# Altium schematic sheet 2_OTHER.schdoc
size 429 x 307 mm; Symbol: Drawing-Symbol_A4; Device: Drawing-Symbol_A4; @Project Name: Custom Keyboard; @Page Count: 2; @Update Date: 2025-12-16; @Create Date: 2025-12-12; @Schematic Name: Custom Keyboard; @Page No: 2; @Page Name: OTHER; Version: V1.0; Page Size: A3; Drawn: Michael Varga; @Create Time: 16:22:12; @Update Time: 17:03:40; Width: 1655; Height: 1170; Region Start: 1; X Region Count: 6; Y Region Count: 4; Blade Width: 10; Title Block Position: 3; @Board Name: Custom Keyboard
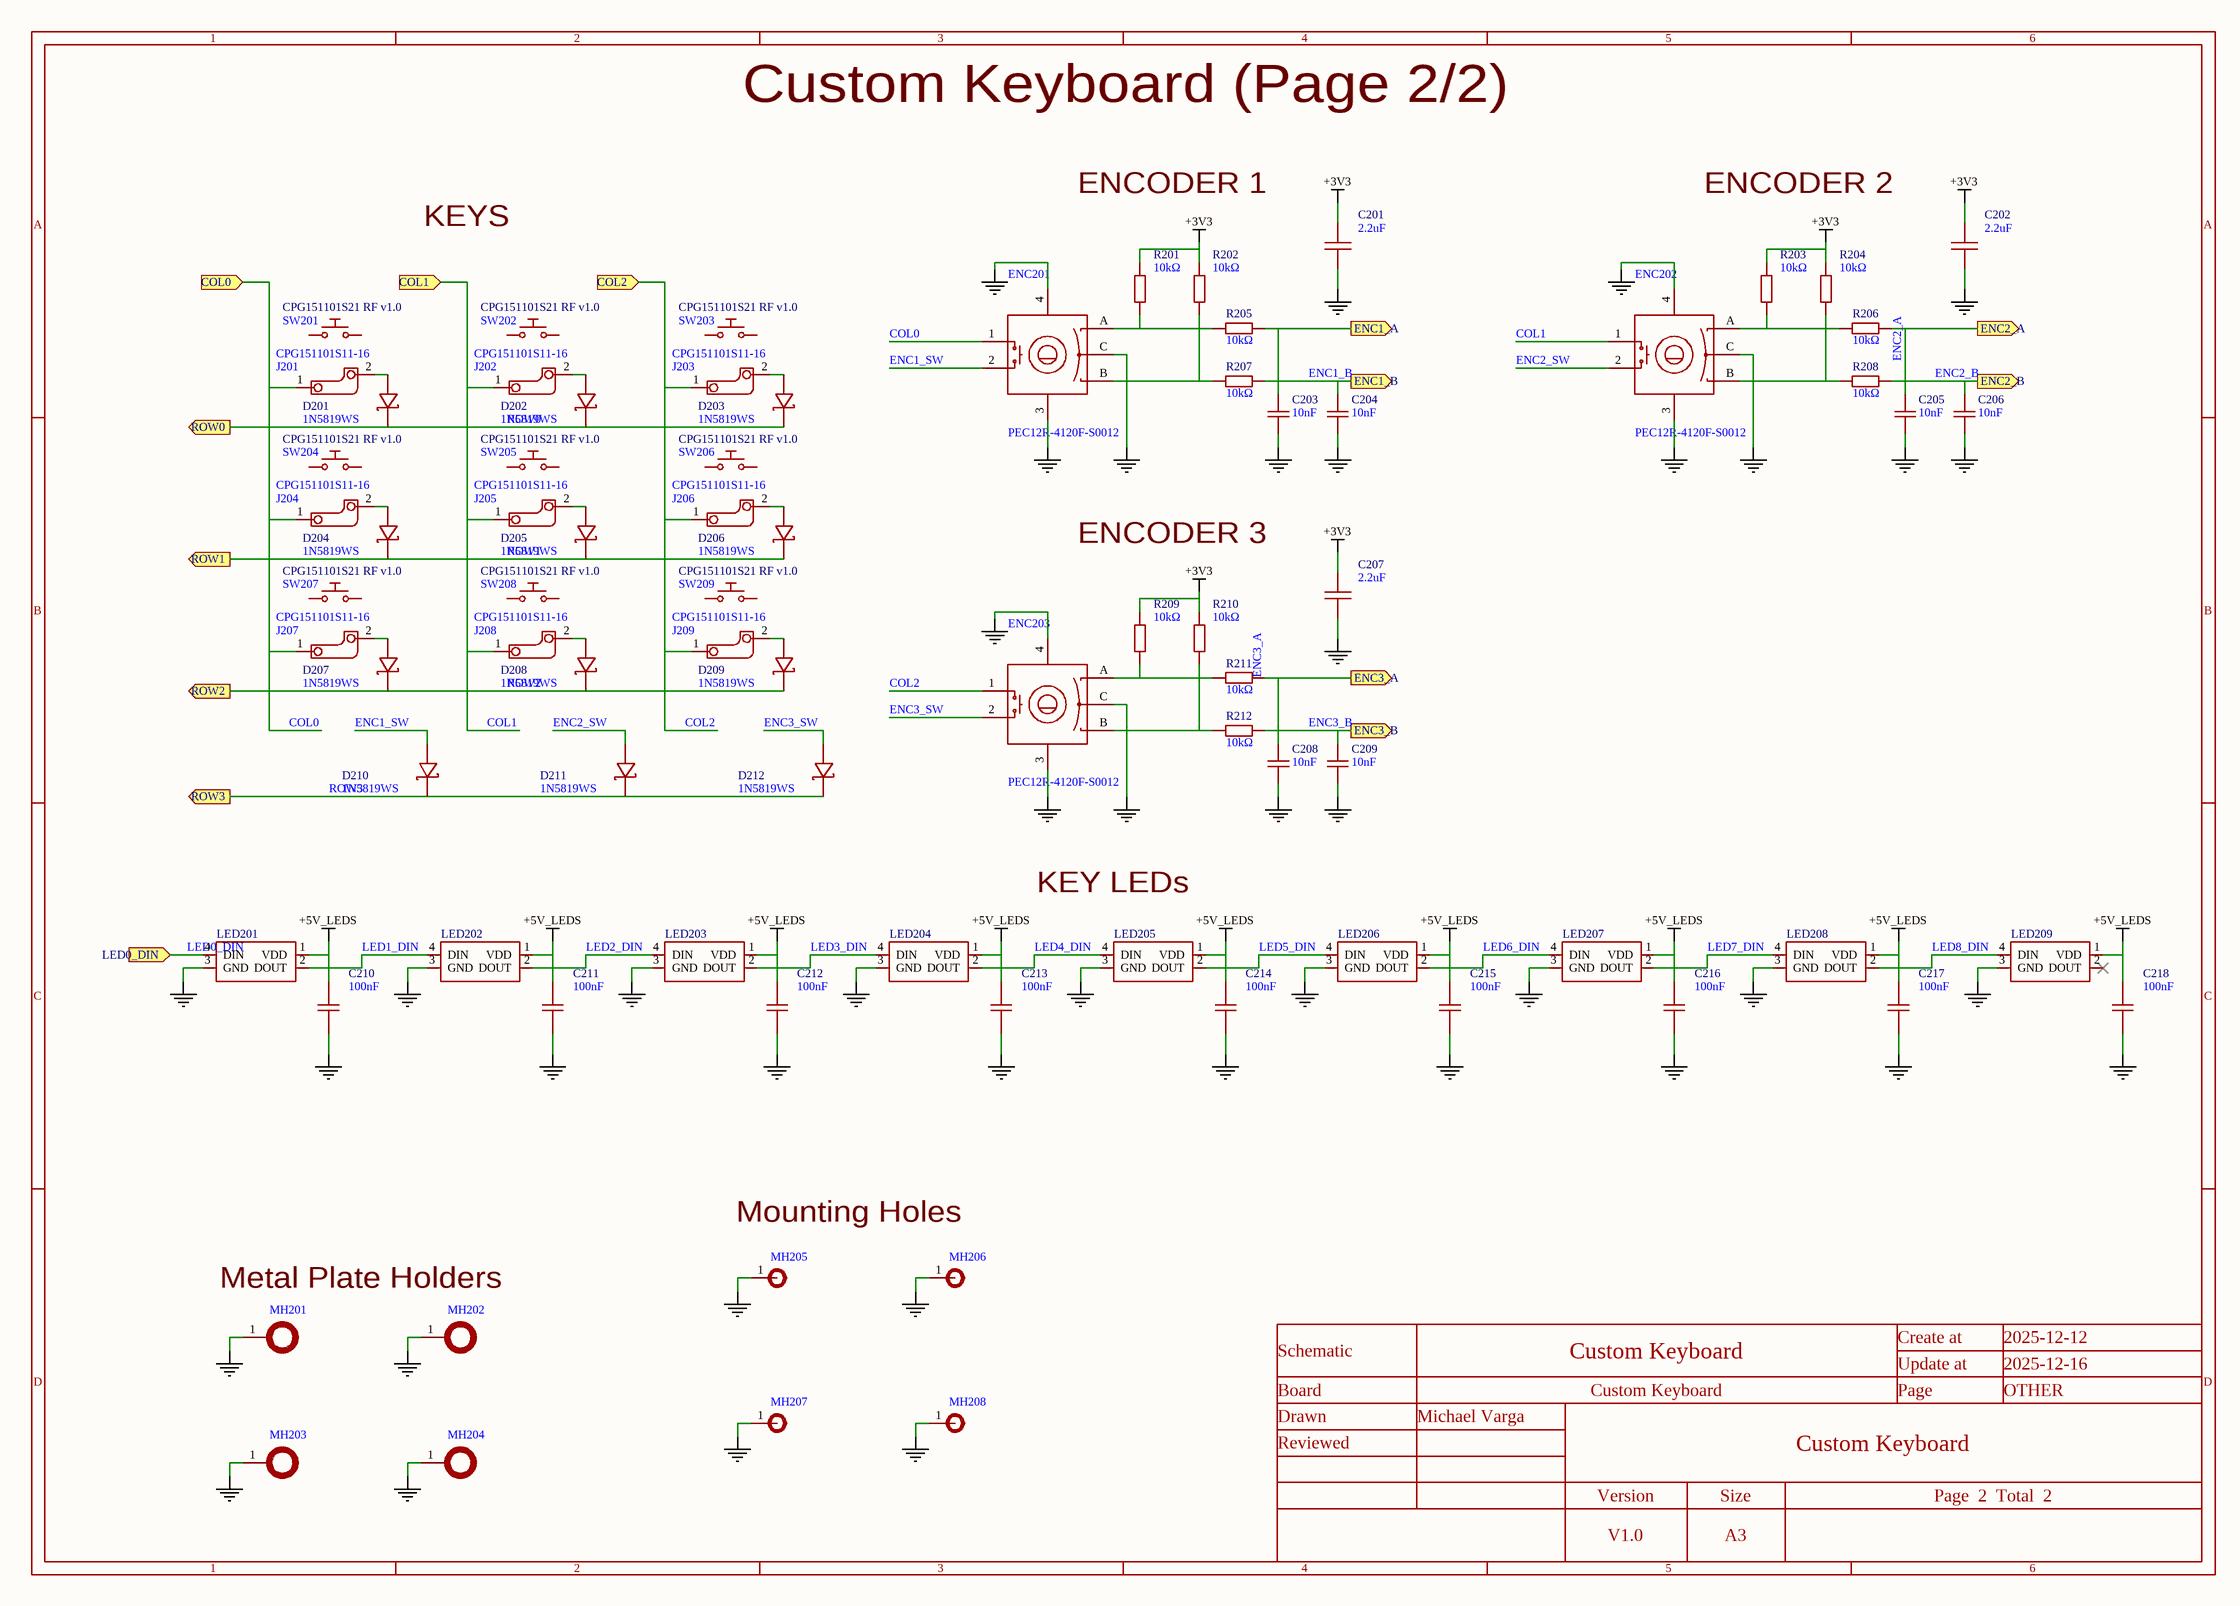
[diagram p0: 2_OTHER.schdoc]

## Parts
C201  2.2uF  [C0402]
C202  2.2uF  [C0402]
C203  10nF  [C0402]
C204  10nF  [C0402]
C205  10nF  [C0402]
C206  10nF  [C0402]
C207  2.2uF  [C0402]
C208  10nF  [C0402]
C209  10nF  [C0402]
C210  100nF  [C0402]
C211  100nF  [C0402]
C212  100nF  [C0402]
C213  100nF  [C0402]
C214  100nF  [C0402]
C215  100nF  [C0402]
C216  100nF  [C0402]
C217  100nF  [C0402]
C218  100nF  [C0402]
D201  1N5819WS  [SOD-323_L1.8-W1.3-LS2.5-RD]
D202  1N5819WS  [SOD-323_L1.8-W1.3-LS2.5-RD]
D203  1N5819WS  [SOD-323_L1.8-W1.3-LS2.5-RD]
D204  1N5819WS  [SOD-323_L1.8-W1.3-LS2.5-RD]
D205  1N5819WS  [SOD-323_L1.8-W1.3-LS2.5-RD]
D206  1N5819WS  [SOD-323_L1.8-W1.3-LS2.5-RD]
D207  1N5819WS  [SOD-323_L1.8-W1.3-LS2.5-RD]
D208  1N5819WS  [SOD-323_L1.8-W1.3-LS2.5-RD]
D209  1N5819WS  [SOD-323_L1.8-W1.3-LS2.5-RD]
D210  1N5819WS  [SOD-323_L1.8-W1.3-LS2.5-RD]
D211  1N5819WS  [SOD-323_L1.8-W1.3-LS2.5-RD]
D212  1N5819WS  [SOD-323_L1.8-W1.3-LS2.5-RD]
ENC201  PEC12R-4120F-S0012  [SW-TH_PEC12R-4120F-S0012]
ENC202  PEC12R-4120F-S0012  [SW-TH_PEC12R-4120F-S0012]
ENC203  PEC12R-4120F-S0012  [SW-TH_PEC12R-4120F-S0012]
J201  CPG151101S11-16  [SMD_KEYBOARD-SW]
J202  CPG151101S11-16  [SMD_KEYBOARD-SW]
J203  CPG151101S11-16  [SMD_KEYBOARD-SW]
J204  CPG151101S11-16  [SMD_KEYBOARD-SW]
J205  CPG151101S11-16  [SMD_KEYBOARD-SW]
J206  CPG151101S11-16  [SMD_KEYBOARD-SW]
J207  CPG151101S11-16  [SMD_KEYBOARD-SW]
J208  CPG151101S11-16  [SMD_KEYBOARD-SW]
J209  CPG151101S11-16  [SMD_KEYBOARD-SW]
LED201  SK6812MINI-E  [LED-SMD_L3.2-W2.8-LS5.9_SK6812MINI-E]  (value not drawn)
LED202  SK6812MINI-E  [LED-SMD_L3.2-W2.8-LS5.9_SK6812MINI-E]  (value not drawn)
LED203  SK6812MINI-E  [LED-SMD_L3.2-W2.8-LS5.9_SK6812MINI-E]  (value not drawn)
LED204  SK6812MINI-E  [LED-SMD_L3.2-W2.8-LS5.9_SK6812MINI-E]  (value not drawn)
LED205  SK6812MINI-E  [LED-SMD_L3.2-W2.8-LS5.9_SK6812MINI-E]  (value not drawn)
LED206  SK6812MINI-E  [LED-SMD_L3.2-W2.8-LS5.9_SK6812MINI-E]  (value not drawn)
LED207  SK6812MINI-E  [LED-SMD_L3.2-W2.8-LS5.9_SK6812MINI-E]  (value not drawn)
LED208  SK6812MINI-E  [LED-SMD_L3.2-W2.8-LS5.9_SK6812MINI-E]  (value not drawn)
LED209  SK6812MINI-E  [LED-SMD_L3.2-W2.8-LS5.9_SK6812MINI-E]  (value not drawn)
MH201  (no value)  [STANDOFF_M2.5x3.5MM_RF_v1.0]
MH202  (no value)  [STANDOFF_M2.5x3.5MM_RF_v1.0]
MH203  (no value)  [STANDOFF_M2.5x3.5MM_RF_v1.0]
MH204  (no value)  [STANDOFF_M2.5x3.5MM_RF_v1.0]
MH205  (no value)  [MH_7.5X3.2MM_RF_v1.0]
MH206  (no value)  [MH_7.5X3.2MM_RF_v1.0]
MH207  (no value)  [MH_7.5X3.2MM_RF_v1.0]
MH208  (no value)  [MH_7.5X3.2MM_RF_v1.0]
R201  10kΩ  [R0402]
R202  10kΩ  [R0402]
R203  10kΩ  [R0402]
R204  10kΩ  [R0402]
R205  10kΩ  [R0402]
R206  10kΩ  [R0402]
R207  10kΩ  [R0402]
R208  10kΩ  [R0402]
R209  10kΩ  [R0402]
R210  10kΩ  [R0402]
R211  10kΩ  [R0402]
R212  10kΩ  [R0402]
SW201  CPG151101S21  [KEY-TH_CPG1511F01S0X]  (value not drawn)
SW202  CPG151101S21  [KEY-TH_CPG1511F01S0X]  (value not drawn)
SW203  CPG151101S21  [KEY-TH_CPG1511F01S0X]  (value not drawn)
SW204  CPG151101S21  [KEY-TH_CPG1511F01S0X]  (value not drawn)
SW205  CPG151101S21  [KEY-TH_CPG1511F01S0X]  (value not drawn)
SW206  CPG151101S21  [KEY-TH_CPG1511F01S0X]  (value not drawn)
SW207  CPG151101S21  [KEY-TH_CPG1511F01S0X]  (value not drawn)
SW208  CPG151101S21  [KEY-TH_CPG1511F01S0X]  (value not drawn)
SW209  CPG151101S21  [KEY-TH_CPG1511F01S0X]  (value not drawn)

## Ports
COL0 (in), COL1 (in), COL2 (in), ENC1_A (out), ENC1_B (out), ENC2_A (out), ENC2_B (out), ENC3_A (out), ENC3_B (out), LED0_DIN (in), ROW0 (out), ROW1 (out), ROW2 (out), ROW3 (out)

## Nets
+3V3: C201.2 C202.2 C207.2 R201.2 R202.2 R203.2 R204.2 R209.2 R210.2
+5V_LEDS: C210.2 C211.2 C212.2 C213.2 C214.2 C215.2 C216.2 C217.2 C218.2 LED201.1(VDD) LED202.1(VDD) LED203.1(VDD) LED204.1(VDD) LED205.1(VDD) LED206.1(VDD) LED207.1(VDD) LED208.1(VDD) LED209.1(VDD)
GND: C201.1 C202.1 C203.1 C204.1 C205.1 C206.1 C207.1 C208.1 C209.1 C210.1 C211.1 C212.1 C213.1 C214.1 C215.1 C216.1 C217.1 C218.1 ENC201.3 ENC201.4 ENC201.C ENC202.3 ENC202.4 ENC202.C ENC203.3 ENC203.4 ENC203.C LED201.3(GND) LED202.3(GND) LED203.3(GND) LED204.3(GND) LED205.3(GND) LED206.3(GND) LED207.3(GND) LED208.3(GND) LED209.3(GND) MH201.1 MH202.1 MH203.1 MH204.1 MH205.1 MH206.1 MH207.1 MH208.1
COL0: ENC201.1 J201.1 J204.1 J207.1 ; port COL0
COL1: ENC202.1 J202.1 J205.1 J208.1 ; port COL1
COL2: ENC203.1 J203.1 J206.1 J209.1 ; port COL2
ENC1_A: C203.2 R205.1 ; port ENC1_A
ENC1_B: C204.2 R207.1 ; port ENC1_B
ENC1_SW: D210.2(A) ENC201.2
ENC2_A: C205.2 R206.1 ; port ENC2_A
ENC2_B: C206.2 R208.1 ; port ENC2_B
ENC2_SW: D211.2(A) ENC202.2
ENC3_A: C208.2 R211.1 ; port ENC3_A
ENC3_B: C209.2 R212.1 ; port ENC3_B
ENC3_SW: D212.2(A) ENC203.2
LED0_DIN: LED201.4(DIN) ; port LED0_DIN
LED1_DIN: LED201.2(DOUT) LED202.4(DIN)
LED2_DIN: LED202.2(DOUT) LED203.4(DIN)
LED3_DIN: LED203.2(DOUT) LED204.4(DIN)
LED4_DIN: LED204.2(DOUT) LED205.4(DIN)
LED5_DIN: LED205.2(DOUT) LED206.4(DIN)
LED6_DIN: LED206.2(DOUT) LED207.4(DIN)
LED7_DIN: LED207.2(DOUT) LED208.4(DIN)
LED8_DIN: LED208.2(DOUT) LED209.4(DIN)
ROW0: D201.1(K) D202.1(K) D203.1(K) ; port ROW0
ROW1: D204.1(K) D205.1(K) D206.1(K) ; port ROW1
ROW2: D207.1(K) D208.1(K) D209.1(K) ; port ROW2
ROW3: D210.1(K) D211.1(K) D212.1(K) ; port ROW3
NetD201_2: D201.2(A) J201.2
NetD202_2: D202.2(A) J202.2
NetD203_2: D203.2(A) J203.2
NetD204_2: D204.2(A) J204.2
NetD205_2: D205.2(A) J205.2
NetD206_2: D206.2(A) J206.2
NetD207_2: D207.2(A) J207.2
NetD208_2: D208.2(A) J208.2
NetD209_2: D209.2(A) J209.2
NetENC201_A: ENC201.A R201.1 R205.2
NetENC201_B: ENC201.B R202.1 R207.2
NetENC202_A: ENC202.A R203.1 R206.2
NetENC202_B: ENC202.B R204.1 R208.2
NetENC203_A: ENC203.A R209.1 R211.2
NetENC203_B: ENC203.B R210.1 R212.2

Not connected (* = marked no-connect by the designer): LED209 2(DOUT)*

## Notes on the sheet
- Custom Keyboard (Page 2/2)
- ENCODER 1
- ENCODER 2
- KEYS
- ENCODER 3
- KEY LEDs
- Mounting Holes
- Metal Plate Holders
- 1
- 2
- 3
- 4
- 5
- 6
- A
- B
- C
- Schematic
- Custom Keyboard
- Create at
- Update at
- 2025-12-12
- 2025-12-16
- D
- Board
- Drawn
- Michael Varga
- Page
- OTHER
- Reviewed
- Version
- Size
- Page  2  Total  2
- V1.0
- A3

## Library data of the parts
C201 C202 C207 = CL05A225MQ5NSNC: Manufacturer: SAMSUNG(三星); Add into BOM: yes; Tolerance: ±20%; Voltage Rating: 6.3V; Temperature Coefficient: X5R; Symbol: CL05A225MQ5NSNC; Device: CL05A225MQ5NSNC; LCSC Part Name: 2.2uF ±20% 6.3V; Supplier Part: C12530; Manufacturer Part: CL05A225MQ5NSNC; Supplier Footprint: 0402; JLCPCB Part Class: Basic Part; Datasheet: https://item.szlcsc.com/datasheet/CL05A225MQ5NSNC/13164.html; Supplier: LCSC; Convert to PCB: yes; Value: 2.2uF
C203-C206 C208 C209 = CL05B103KB5NNNC: Manufacturer: SAMSUNG(三星); Add into BOM: yes; Tolerance: ±10%; Voltage Rating: 50V; Temperature Coefficient: X7R; Symbol: CL05B103KB5NNNC; Device: CL05B103KB5NNNC; LCSC Part Name: 10nF ±10% 50V; Supplier Part: C15195; Manufacturer Part: CL05B103KB5NNNC; Supplier Footprint: 0402; JLCPCB Part Class: Basic Part; Datasheet: https://item.szlcsc.com/datasheet/CL05B103KB5NNNC/15869.html; Supplier: LCSC; Convert to PCB: yes; Value: 10nF
C210-C218 = CL05B104KO5NNNC: Manufacturer: SAMSUNG(三星); Add into BOM: yes; Tolerance: ±10%; Voltage Rating: 16V; Temperature Coefficient: X7R; Symbol: CL05B104KO5NNNC; Device: CL05B104KO5NNNC; LCSC Part Name: 100nF ±10% 16V; Supplier Part: C1525; Manufacturer Part: CL05B104KO5NNNC; Supplier Footprint: 0402; JLCPCB Part Class: Basic Part; Datasheet: https://item.szlcsc.com/datasheet/CL05B104KO5NNNC/1877.html; Supplier: LCSC; Convert to PCB: yes; Value: 100nF
D201-D212 = 1N5819WS_C191023: Manufacturer: Hottech(合科泰); Add into BOM: yes; Voltage - Forward(Vf@If): 600mV@1A; Voltage - DC Reverse(Vr): 40V; Current - Rectified: 1A; Non-Repetitive Peak Forward Surge Current: 25A; Symbol: 1N5819WS; Device: 1N5819WS_C191023; LCSC Part Name: 电压:40V 电流:1A; Supplier Part: C191023; Manufacturer Part: 1N5819WS; Supplier Footprint: SOD-323; JLCPCB Part Class: Basic Part; Datasheet: https://item.szlcsc.com/datasheet/1N5819WS/213850.html; Supplier: LCSC; Convert to PCB: yes
ENC201-ENC203 = PEC12R-4120F-S0012_RF_v1.0: Manufacturer: BOURNS; Add into BOM: yes; Symbol: PEC12R-4120F-S0012_RF_v1.0; Device: PEC12R-4120F-S0012_RF_v1.0; LCSC Part Name: PEC12R-4120F-S0012; Supplier Part: C143801; Manufacturer Part: PEC12R-4120F-S0012; Supplier Footprint: 插件; Datasheet: https://item.szlcsc.com/datasheet/PEC12R-4120F-S0012/155132.html; Supplier: LCSC; Convert to PCB: yes
J201-J209 = CPG151101S11-16_RF_v1.0: Manufacturer: Kailh(凯华); Add into BOM: yes; Operating Voltage: 2V~12V; Symbol: CPG151101S11-16_RF_v1.0; Device: CPG151101S11-16_RF_v1.0; LCSC Part Name: CPG151101S11-16; Supplier Part: C5156480; Manufacturer Part: CPG151101S11-16; Supplier Footprint: -; Datasheet: https://atta.szlcsc.com/upload/public/pdf/source/20220829/33DFC1A320A078D20879F2B21562B513.pdf; Supplier: LCSC; Convert to PCB: yes; Axis Type: -; Pin: -; Mechanical Life: -; Operation Force: -; Conduction Travel: -; Total Travel: -; Operating Temperature: -
LED201-LED209 = SK6812MINI-E_C5149201: Manufacturer: 欧思科光电; Add into BOM: yes; Symbol: SK6812MINI-E_C5149201; Device: SK6812MINI-E_C5149201; LCSC Part Name: SK6812MINI-E; Supplier Part: C5149201; Manufacturer Part: SK6812MINI-E; Supplier Footprint: SMD; JLCPCB Part Class: Extended Part; Datasheet: https://item.szlcsc.com/datasheet/SK6812MINI-E/5773397.html; Supplier: LCSC; Convert to PCB: yes
MH201-MH204 = 9774035151R_RF_v1.0: Add into BOM: yes; Symbol: 9774035151R_RF_v1.0; Device: 9774035151R_RF_v1.0; Convert to PCB: yes
MH205-MH208 = MH_7.5X3.2MM_RF_v1.0: Add into BOM: yes; Symbol: MH_7.5X3.2MM_RF_v1.0; Device: MH_7.5X3.2MM_RF_v1.0; Convert to PCB: yes
R201-R212 = 0402WGF1002TCE: Manufacturer: UNI-ROYAL(厚声); Add into BOM: yes; Tolerance: ±1%; Power(Watts): 62.5mW; Voltage-Supply(Max): 50V; Temperature Coefficient: ±100ppm/℃; Symbol: 0402WGF1002TCE; Device: 0402WGF1002TCE; LCSC Part Name: 10kΩ ±1% 62.5mW 厚膜电阻; Supplier Part: C25744; Manufacturer Part: 0402WGF1002TCE; Supplier Footprint: 0402; JLCPCB Part Class: Basic Part; Datasheet: https://item.szlcsc.com/datasheet/0402WGF1002TCE/26487.html; Supplier: LCSC; Convert to PCB: yes; Type: Thick Film Resistor; Value: 10kΩ; Operating Temperature: -55℃~+155℃
SW201-SW209 = CPG151101S21 RF v1.0: Manufacturer: Kailh(凯华); Add into BOM: yes; Axis Type: Red Axis; Operating Voltage: 2V~12V; Mechanical Life: 70 Million Times; Operation Force: 50gf@±10gf; Conduction Travel: 1.9mm; Total Travel: 4mm; Symbol: CPG151101S21 RF v1.0; Device: CPG151101S21 RF v1.0; LCSC Part Name: KT 红轴; Supplier Part: C404351; Manufacturer Part: CPG151101S21; Supplier Footprint: 插件; Datasheet: https://atta.szlcsc.com/upload/public/pdf/source/20190830/C404351_7D6B52E742ECF8B3BC352AD1FDA65BD7.pdf; Supplier: LCSC; Convert to PCB: yes; Pin: 2; Operating Temperature: -10℃~+70℃